# Altium schematic sheet USB2XXX.SchDoc
size A3
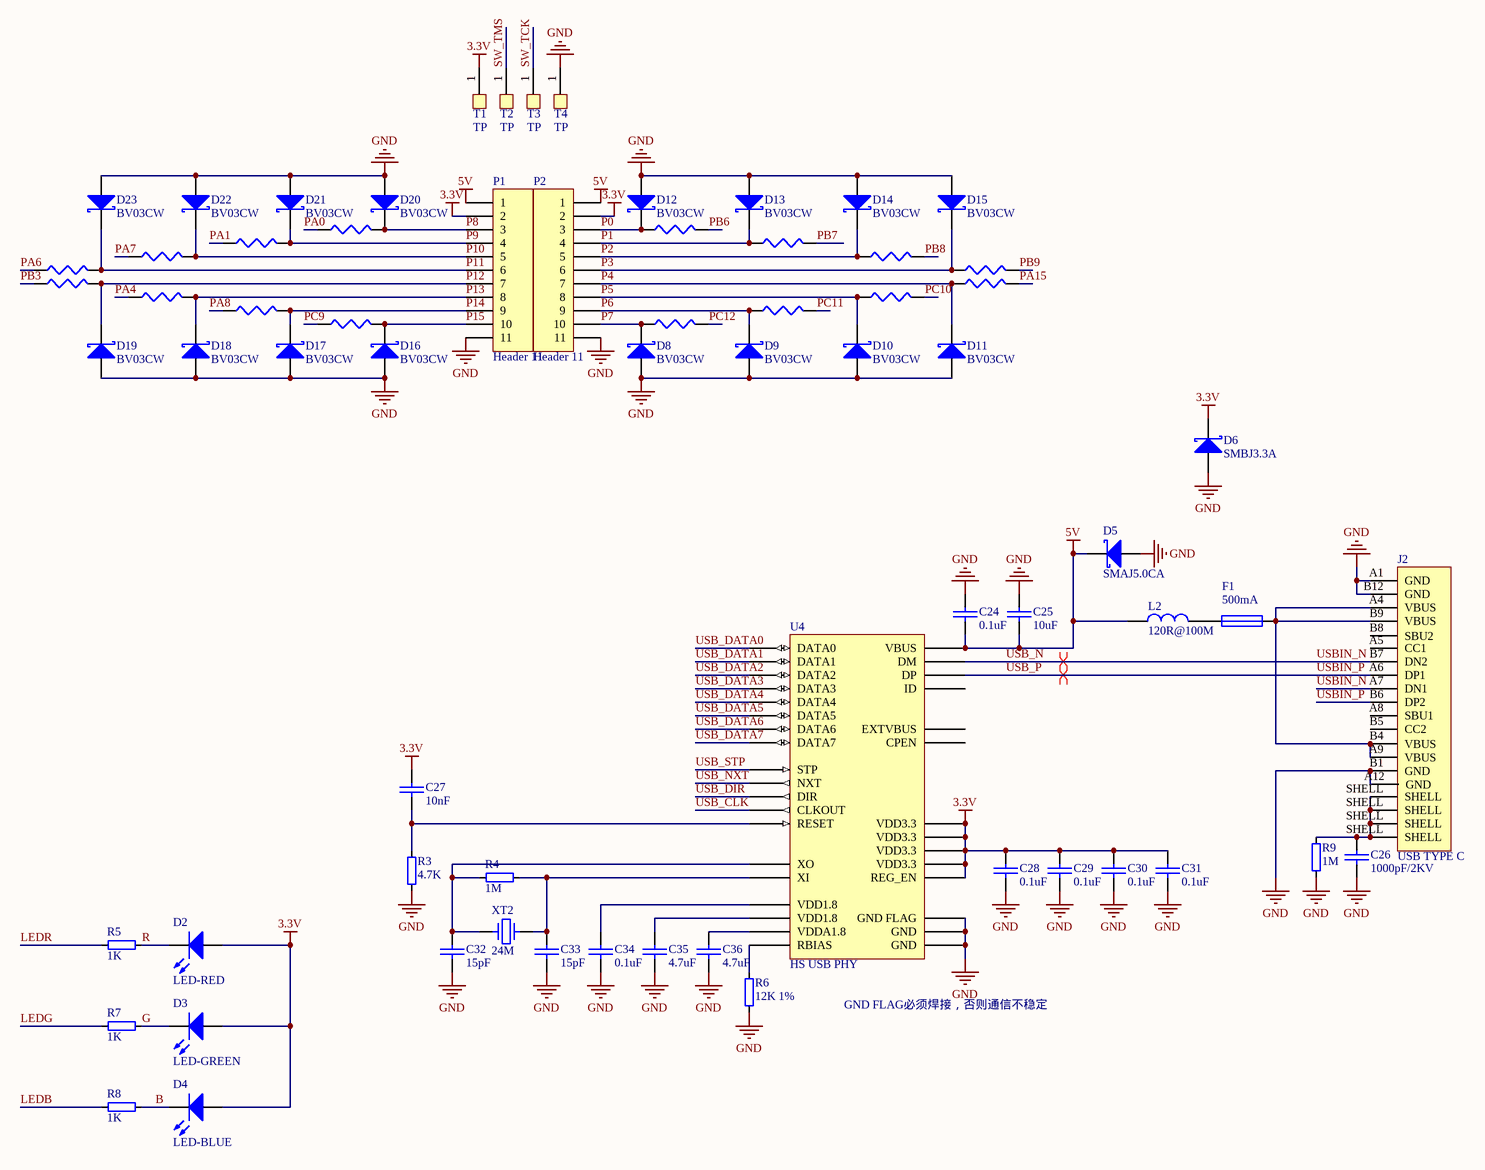
[diagram p0: USB2XXX.SchDoc]

## Parts
C24  0.1uF  [C0402]
C25  10uF  [C0603]
C26  1000pF/2KV  [C1206]
C27  10nF  [C0402]
C28  0.1uF  [C0402]
C29  0.1uF  [C0402]
C30  0.1uF  [C0402]
C31  0.1uF  [C0402]
C32  15pF  [C0402]
C33  15pF  [C0402]
C34  0.1uF  [C0402]
C35  4.7uF  [C0402]
C36  4.7uF  [C0402]
D2  LED-RED  [LED0603R]
D3  LED-GREEN  [LED0603G]
D4  LED-BLUE  [LED0603B]
D5  SMAJ5.0CA  [DO-214AC]
D6  SMBJ3.3A  [DO-214AA]
D8  BV03CW  [SOD323]
D9  BV03CW  [SOD323]
D10  BV03CW  [SOD323]
D11  BV03CW  [SOD323]
D12  BV03CW  [SOD323]
D13  BV03CW  [SOD323]
D14  BV03CW  [SOD323]
D15  BV03CW  [SOD323]
D16  BV03CW  [SOD323]
D17  BV03CW  [SOD323]
D18  BV03CW  [SOD323]
D19  BV03CW  [SOD323]
D20  BV03CW  [SOD323]
D21  BV03CW  [SOD323]
D22  BV03CW  [SOD323]
D23  BV03CW  [SOD323]
F1  500mA  [R0805]
J2  USB TYPE C  [USB3.1_16P]
L2  120R@100M  [R0603]
P1  Header 11  [HDR1X11]
P2  Header 11  [HDR1X11]
R3  4.7K  [R0402]
R4  1M  [R0402]
R5  1K  [R0402]
R6  12K 1%  [R0402]
R7  1K  [R0402]
R8  1K  [R0402]
R9  1M  [R0402]
R10  0R  [R0402]  (value not drawn)
R11  0R  [R0402]  (value not drawn)
R12  0R  [R0402]  (value not drawn)
R13  0R  [R0402]  (value not drawn)
R14  0R  [R0402]  (value not drawn)
R15  0R  [R0402]  (value not drawn)
R16  0R  [R0402]  (value not drawn)
R17  0R  [R0402]  (value not drawn)
R18  0R  [R0402]  (value not drawn)
R19  0R  [R0402]  (value not drawn)
R20  0R  [R0402]  (value not drawn)
R21  0R  [R0402]  (value not drawn)
R22  0R  [R0402]  (value not drawn)
R23  0R  [R0402]  (value not drawn)
R24  0R  [R0402]  (value not drawn)
R25  0R  [R0402]  (value not drawn)
T1  TP  [TP15]
T2  TP  [TP15]
T3  TP  [TP15]
T4  TP  [TP15]
U4  HS USB PHY
XT2  24M  [CRYSTAL-SMD-5032]

## Nets
3.3V: C27.2 C28.2 C29.2 C30.2 C31.2 D2.1(A) D3.1(A) D4.1(A) D6.2(K) P1.2 P2.2 T1.1 U4.6(VDD3.3) U4.16(VDD3.3) U4.25(VDD3.3) U4.30(VDD3.3) U4.31(REG_EN)
5V: C24.1 C25.1 D5.2(K) L2.1 P1.1 P2.1 U4.4(VBUS)
GND: C24.2 C25.2 C26.2 C28.1 C29.1 C30.1 C31.1 C32.1 C33.1 C34.1 C35.1 C36.1 D5.1(A) D6.1(A) D8.1(A) D9.1(A) D10.1(A) D11.1(A) D12.1(A) D13.1(A) D14.1(A) D15.1(A) D16.1(A) D17.1(A) D18.1(A) D19.1(A) D20.1(A) D21.1(A) D22.1(A) D23.1(A) J2.A1(GND) J2.A12(GND) J2.B1(GND) J2.B12(GND) P1.11 P2.11 R3.1 R6.1 R9.1 T4.1 U4.0(GND_FLAG) U4.1(GND) U4.2(GND)
B: D4.2(K) R8.2
G: D3.2(K) R7.2
LEDB: R8.1
LEDG: R7.1
LEDR: R5.1
P0: D12.2(K) P2.3 R18.1
P1: D13.2(K) P2.4 R19.1
P2: D14.2(K) P2.5 R20.1
P3: D15.2(K) P2.6 R21.1
P4: D11.2(K) P2.7 R22.1
P5: D10.2(K) P2.8 R23.1
P6: D9.2(K) P2.9 R24.1
P7: D8.2(K) P2.10 R25.1
P8: D20.2(K) P1.3 R10.2
P9: D21.2(K) P1.4 R11.2
P10: D22.2(K) P1.5 R12.2
P11: D23.2(K) P1.6 R13.2
P12: D19.2(K) P1.7 R14.2
P13: D18.2(K) P1.8 R15.2
P14: D17.2(K) P1.9 R16.2
P15: D16.2(K) P1.10 R17.2
PA0: R10.1
PA1: R11.1
PA4: R15.1
PA6: R13.1
PA7: R12.1
PA8: R16.1
PA15: R22.2
PB3: R14.1
PB6: R18.2
PB7: R19.2
PB8: R20.2
PB9: R21.2
PC9: R17.1
PC10: R23.2
PC11: R24.2
PC12: R25.2
R: D2.2(K) R5.2
SW_TCK: T3.1
SW_TMS: T2.1
USB_CLK: U4.14(CLKOUT)
USB_DATA0: U4.24(DATA0)
USB_DATA1: U4.23(DATA1)
USB_DATA2: U4.22(DATA2)
USB_DATA3: U4.21(DATA3)
USB_DATA4: U4.20(DATA4)
USB_DATA5: U4.19(DATA5)
USB_DATA6: U4.18(DATA6)
USB_DATA7: U4.17(DATA7)
USB_DIR: U4.12(DIR)
USB_N: J2.A7(DN1) J2.B7(DN2) U4.8(DM)  [also labelled USBIN_N]
USB_NXT: U4.11(NXT)
USB_P: J2.A6(DP1) J2.B6(DP2) U4.7(DP)  [also labelled USBIN_P]
USB_STP: U4.13(STP)
NetC26_1: C26.1 J2.SHELL R9.2
NetC27_1: C27.1 R3.2 U4.9(RESET)
NetC32_2: C32.2 R4.1 U4.27(XO) XT2.1
NetC33_2: C33.2 R4.2 U4.28(XI) XT2.2
NetC34_2: C34.2 U4.15(VDD1.8)
NetC35_2: C35.2 U4.26(VDD1.8)
NetC36_2: C36.2 U4.29(VDDA1.8)
NetF1_1: F1.1 L2.2
NetF1_2: F1.2 J2.A4(VBUS) J2.A9(VBUS) J2.B4(VBUS) J2.B9(VBUS)
NetR6_2: R6.2 U4.32(RBIAS)

Not connected (* = marked no-connect by the designer): J2 A5(CC1) A8(SBU1) B5(CC2) B8(SBU2); U4 3(CPEN) 5(ID) 10(EXTVBUS)

## Layout directives
differential pair: USB_N, USB_P

## Notes on the sheet
- GND FLAG必须焊接，否则通信不稳定

## Library data of the parts
C24-C36 = Capacitor
D2-D4 = LED
D5 D6 D8-D23 = Diode Schottky
F1 = FUSE1: FUSE
J2 = USB_TYPE_C
L2 = Inductor
P1 P2 = Header 11: Header, 11-Pin; LatestRevisionDate: 17-Jul-2002; LatestRevisionNote: Re-released for DXP Platform.; Publisher: Altium Limited
R3-R9 = R-10K: resistor
R10-R25 = Resistance
U4 = USB3300: 高速USB外置PHY
XT2 = XT: 晶振